# EasyEDA Pro project ProDoc_FDSKey_PCB.epro

# Board PCB1_6
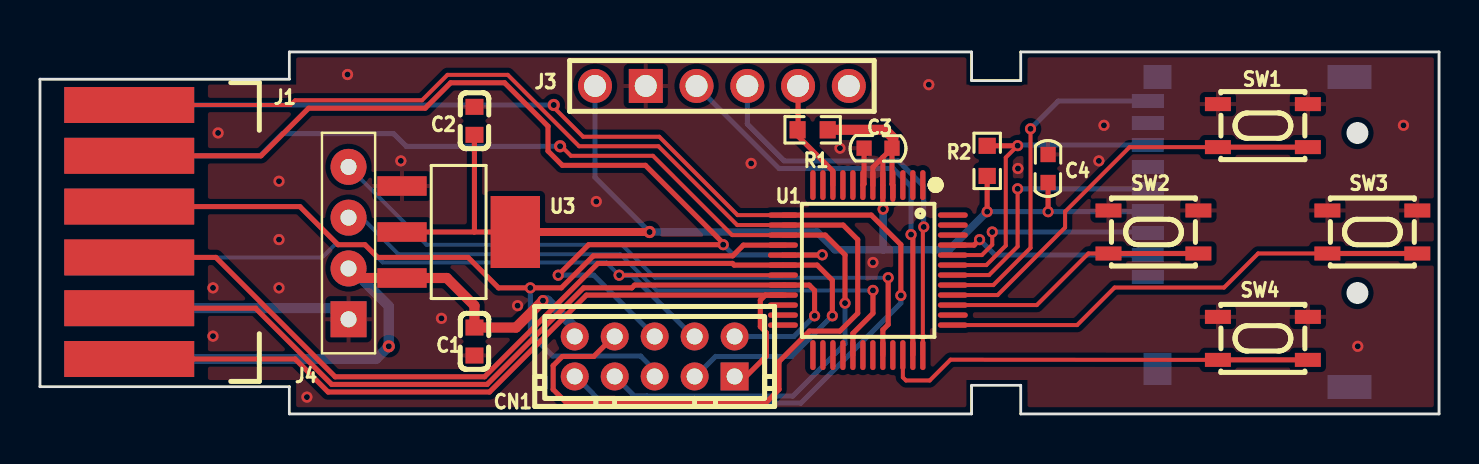
[diagram p0: board, top side]
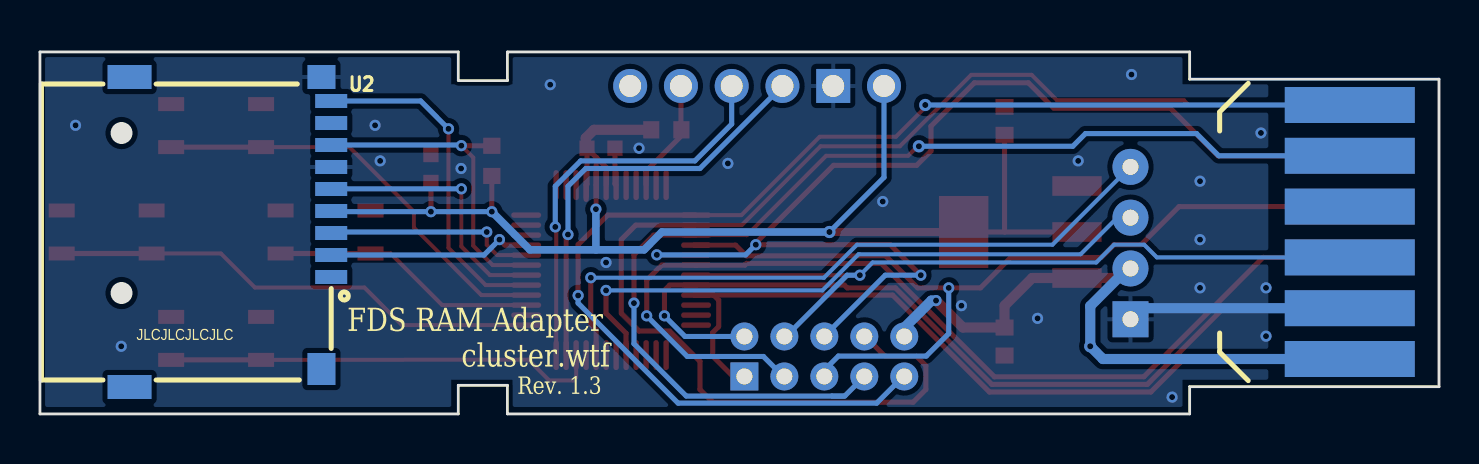
[diagram p1: board, bottom side, seen from below]

Outline 70 x 18.1 mm; copper layers: Top Layer, Bottom Layer. Coordinates in mm from the lower left corner of the outline.
Outline path: 0,16.74 12.48,16.74 12.48,18.1 46.61,18.1 46.61,16.67 49.07,16.67 49.07,18.1 70,18.1 70,0 49.07,0 49.07,1.43 46.61,1.43 46.61,0 12.48,0 12.48,1.36 0,1.36 0,16.74
Stack: Top Layer 0.035mm / Dielectric1 1.51mm FR4 er 4.5 / Bottom Layer 0.035mm

## Design rules (mm)
template: JLCPCB Capability(Two Layers Board)
spacing copperThickness1oz (default): track to track 0.102, other pairs 0.152 to 0.3
spacing copperThickness2oz: track to track 0.203, other pairs 0.152 to 0.3
track width copperThickness1oz (default): min 0.127, default 0.254, max 2.54
track width copperThickness2oz: min 0.203, default 0.254, max 2.54
differential pair differentialPair (default): width min 0.127, default 0.254, max 2.54; gap min 0.152, default 0.152
via viaSize (default): diameter min 0.5, default 0.61, max 10; hole min 0.3, default 0.305, max 6.3

## Placement (name value [footprint] x y rotation side)
C1  4.7uF  [C0603#2]  21.74 3.62 270 top
C2  4.7uF  [C0603#2]  21.74 14.65 270 top
C3  100nF  [C0603]  41.93 13.29 0 top
C4  100nF  [C0603]  50.44 12.27 270 top
CN1  A2004-2X05A  [CONN-TH_10P-P2.00_A2004WV-2X05P]  30.75 2.87 0 top
J1  -  [FDS_RAM_ADAPTOR]  0.66 17.03 270 top
J3  SWD  [hdr-1x6t/2.54/15x2]  34.12 16.4 0 top
J4  -  [OLED_0.91]  13.99 2.49 0 top
R1  1.5kΩ  [R0603]  38.66 14.21 180 top
R2  1.5kΩ  [R0603]  47.39 12.65 270 top
SW1  3*4*2.5mm 贴片4脚  [SW-SMD_4P-L4.2-W3.3-P2.15-LS5.1]  61.19 14.41 180 top
SW2  3*4*2.5mm 贴片4脚  [SW-SMD_4P-L4.2-W3.3-P2.15-LS5.1]  55.71 9.1 180 top
SW3  3*4*2.5mm 贴片4脚  [SW-SMD_4P-L4.2-W3.3-P2.15-LS5.1]  66.66 9.1 180 top
SW4  3*4*2.5mm 贴片4脚  [SW-SMD_4P-L4.2-W3.3-P2.15-LS5.1]  61.19 3.78 180 top
U1  STM32G0B0CET6  [LQFP-48_L7.0-W7.0-P0.50-LS9.0-BL]  41.42 7.19 180 top
U2  A102-206017-001  [SIM-SMD_A102-206017-001]  60.47 9.1 270 bottom
U3  -  [SOT-223-4_L6.5-W3.5-P2.30-LS7.0-BR]  20.95 9.1 180 top

## Footprints (pads in the part's own frame, mm; a bottom-side part is the same pattern mirrored in y, then rotated)
C0603
  rect 0.762x0.762 smd: 1(-0.699,0) 2(0.699,0)
C0603#2
  rect 0.8x0.9 smd: 1(-0.7,0) 2(0.7,0)
CONN-TH_10P-P2.00_A2004WV-2X05P
  rect 1.4x1.4 hole 0.8: 1(4,-1)
  round 1.4 hole 0.8: 2(4,1) 3(2,-1) 4(2,1) 5(0,-1) 6(0,1) 7(-2,-1) 8(-2,1) 9(-4,-1) 10(-4,1)
FDS_RAM_ADAPTOR
  rect 1.8x6.5 smd: 1(14.288,3.81) 3(11.747,3.81) 5(9.207,3.81) 7(6.668,3.81) 9(4.128,3.81) 11(1.587,3.81)
  rect 1.8x6.5 smd far side: 2(14.288,3.81) 4(11.747,3.81) 6(9.207,3.81) 8(6.668,3.81) 10(4.128,3.81) 12(1.587,3.81)
hdr-1x6t/2.54/15x2
  round 1.7 hole 1.1: 1(-6.35,0) 3(-1.27,0) 4(1.27,0) 5(3.81,0) 6(6.35,0)
  rect 1.7x1.7 hole 1.1: 2(-3.81,0)
LQFP-48_L7.0-W7.0-P0.50-LS9.0-BL
  oval 0.27x1.5 smd: 1(-2.75,-4.25) 2(-2.25,-4.25) 3(-1.75,-4.25) 4(-1.25,-4.25) 5(-0.75,-4.25) 6(-0.25,-4.25) 7(0.25,-4.25) 8(0.75,-4.25) 9(1.25,-4.25) 10(1.75,-4.25) 11(2.25,-4.25) 12(2.75,-4.25) 25(2.75,4.25) 26(2.25,4.25) 27(1.75,4.25) 28(1.25,4.25) 29(0.75,4.25) 30(0.25,4.25) 31(-0.25,4.25) 32(-0.75,4.25) 33(-1.25,4.25) 34(-1.75,4.25) 35(-2.25,4.25) 36(-2.75,4.25)
  oval 1.5x0.27 smd: 13(4.25,-2.75) 14(4.25,-2.25) 15(4.25,-1.75) 16(4.25,-1.25) 17(4.25,-0.75) 18(4.25,-0.25) 19(4.25,0.25) 20(4.25,0.75) 21(4.25,1.25) 22(4.25,1.75) 23(4.25,2.25) 24(4.25,2.75) 37(-4.25,2.75) 38(-4.25,2.25) 39(-4.25,1.75) 40(-4.25,1.25) 41(-4.25,0.75) 42(-4.25,0.25) 43(-4.25,-0.25) 44(-4.25,-0.75) 45(-4.25,-1.25) 46(-4.25,-1.75) 47(-4.25,-2.25) 48(-4.25,-2.75)
OLED_0.91
  rect 1.8x1.8 hole 0.8: 1(1.447,2.241)
  round 1.8 hole 0.8: 2(1.447,4.781) 3(1.447,7.321) 4(1.447,9.861)
R0603
  rect 0.806x0.864 smd: 1(-0.753,0) 2(0.753,0)
SIM-SMD_A102-206017-001
  rect 0.7x1.6 smd: 1(2.25,5.045) 2(1.15,5.045) 3(0.05,5.045) 4(-1.05,5.045) 5(-2.15,5.045) 6(-3.25,5.045) 7(-4.35,5.045) 8(-5.45,5.045) SD(-6.55,5.045)
  rect 1.6x1.4 smd: 11(6.85,4.555)
  rect 1.2x2.2 smd: 12(-7.75,-5.045) 13(7.75,-5.045)
  rect 1.2x1.4 smd: G(-7.75,4.555)
SOT-223-4_L6.5-W3.5-P2.30-LS7.0-BR
  rect 2.47x0.98 smd: 1(2.835,-2.3) 2(2.835,0) 3(2.835,2.3)
  rect 2.47x3.6 smd: 4(-2.835,0)
SW-SMD_4P-L4.2-W3.3-P2.15-LS5.1
  rect 1.3x0.7 smd: 1(-2.25,1.075) 2(2.25,1.075) 3(-2.25,-1.075) 4(2.25,-1.075)

## Nets
3.3V: C2.2 C3.2 C4.2 J3.1 R1.1 R2.2 U1.4 U1.5 U1.6 U2.4 U3.2 U3.4
+5V: C1.1 CN1.10 J1.2 J4.2 U3.3
GND: C1.2 C2.1 C3.1 C4.1 J1.4 J3.2 J4.1 SW1.3 SW1.4 SW2.3 SW2.4 SW3.3 SW3.4 SW4.3 SW4.4 U1.7 U2.6 U2.G U3.1
BUTTON_1: SW1.1 SW1.2 U1.40
BUTTON_2: SW2.1 SW2.2 U1.39
BUTTON_3: SW3.1 SW3.2 U1.37
BUTTON_4: SW4.1 SW4.2 U1.34
I2C_SCL: J4.3 U1.29
I2C_SDA: J4.4 U1.32
MEDIA_SET: CN1.7 J1.10 U1.15
MOTOR_ON: CN1.4 J1.6 U1.19
NRST: J3.5 R1.2 U1.10
READ_DATA: CN1.6 J1.9 U1.17
READY: CN1.8 J1.11 U1.14
SCAN_MEDIA: CN1.2 J1.3 U1.20
SD_CLK: U1.42 U2.5
SD_CS: U1.45 U2.2
SD_DTCT: U1.41 U2.SD
SD_MISO: R2.1 U1.43 U2.7
SD_MOSI: U1.44 U2.3
STOP_MOTOR: CN1.9 J1.12 U1.13
SWCLK: J3.4 U1.36
SWDIO: J3.3 U1.35
WRITABLE_MEDIA: CN1.5 J1.7 U1.16
WRITE: CN1.1 J1.1 U1.21
WRITE_DATA: CN1.3 J1.5 U1.18

Pads without a net: J1 8; J3 6; U1 1 2 3 8 9 11 12 22 23 24 25 26 27 28 30 31 33 38 46 47 48; U2 1 8 11 12 13

## Via types
v1: diameter 0.559, hole 0.3, Top Layer to Bottom Layer, 41 vias
v2: diameter 0.559, hole 0.305, Top Layer to Bottom Layer, 2 vias
v3: diameter 0.61, hole 0.305, Top Layer to Bottom Layer, 4 vias

## Routing (per net, layer and track width the routed paths; a pad name or vN(x,y) marks a point on that pad's centre or on a via; arc(x,y) is an arc through that point)
3.3V: length 68.2
  Top Layer w0.254: 42.67,10.73 U1.4 42.63,11.48 C3.2 42.17,12.83 ; 42.17,12.83 U1.5 42.17,10.23 v1(42.18,10.24) ; 42.17,12.83 41.67,12.33 U1.6 ; 21.73,9.1 U3.2 ; 21.73,9.1 21.74,9.11 C2.2 ; 21.73,9.1 U3.4 ; v1(50.44,10.11) C4.2 ; v1(47.39,10.11) R2.2
  Top Layer w0.4: U3.4 30.24,9.1
  Top Layer w0.508: C3.2 42.69,13.35 42.69,13.79 42.28,14.21 R1.1
  Bottom Layer w0.254: U2.4 55.39,10.11 v1(50.44,10.11) v1(47.39,10.11) ; J3.1 27.77,11.83 v3(30.5,9.1)
  Bottom Layer w0.381: 42.18,8.21 39.77,8.21 38.88,9.1 v3(30.5,9.1) ; 42.18,8.21 v1(42.18,10.24) ; 42.18,8.21 45.49,8.21 v1(47.39,10.11)
+5V: length 33.3
  Top Layer w0.508: v1(25.17,5.67) 23.82,4.32 C1.1 21.74,5.41 20.35,6.8 U3.3 15.92,6.8 15.49,7.23
  Bottom Layer w0.508: v1(25.17,5.67) 25.4,5.67 26.75,4.31 CN1.10 ; 3.78,2.75 16.82,2.75 v3(17.45,3.38) 17.45,5.39 15.61,7.23 15.49,7.23
GND: length 13.8
  Top Layer w0.254: C3.1 41.23,11.5 U1.7
  Bottom Layer w0.508: 3.78,5.29 14.89,5.29 15.49,4.69
  vias: v1(8.66,6.3) v1(8.66,3.89) v1(8.91,14.05) v1(11.96,11.64) v1(11.96,8.71) v1(11.96,6.3) v1(13.36,0.84) v1(15.39,16.97) v1(18.05,12.65) v1(20.09,4.78) v1(23.9,5.41) v1(27.83,10.62) v1(35.58,12.52) v1(40.03,13.29) v1(41.68,7.57) v1(44.47,16.46) v1(48.93,12.27) v1(52.98,12.65) v1(53.23,14.43) v1(65.93,3.38) v1(68.22,14.43)
BUTTON_1: length 21.6
  Top Layer w0.2: 59.22,13.34 54.52,13.34 51.29,10.11 51.29,9.32 47.91,5.94 U1.40
  Top Layer w0.254: SW1.1 58.94,13.34
BUTTON_2: length 13.6
  Top Layer w0.2: 53.74,8.02 52.45,8.02 49.87,5.44 U1.39
  Top Layer w0.254: 57.96,8.02 53.46,8.02
BUTTON_3: length 25
  Top Layer w0.2: 64.69,8.02 60.95,8.02 59.24,6.32 53.77,6.32 51.89,4.44 U1.37
  Top Layer w0.254: 64.41,8.02 68.91,8.02
BUTTON_4: length 22.2
  Top Layer w0.2: 59.22,2.7 45.56,2.71 44.52,1.67 43.33,1.67 43.17,1.83 U1.34
  Top Layer w0.254: SW4.1 58.94,2.7
I2C_SCL: length 31.3
  Top Layer w0.254: U1.29 40.67,4.03 41.68,5.03 v1(41.68,6.17)
  Bottom Layer w0.2: 15.49,9.77 16.14,9.77 17.93,7.98 29.04,7.98 30.85,6.17 v1(41.68,6.17)
I2C_SDA: length 33.2
  Top Layer w0.254: U1.32 42.17,4.2 42.44,4.47 v1(42.44,6.81)
  Bottom Layer w0.2: 15.49,12.31 19.34,8.46 29.12,8.46 30.77,6.81 v1(42.44,6.81)
MEDIA_SET: length 57.8
  Top Layer w0.2: 25.9,13.38 26.09,13.38 26.56,12.91 30.67,12.91 34.63,8.94 U1.15
  Top Layer w0.254: U1.15 39.29,8.94 40.28,7.95 v1(40.28,5.54)
  Bottom Layer w0.254: v3(26.02,13.38) 18.32,13.38 17.69,14.02 12.13,14.02 11.02,12.91 3.78,12.91 ; 29.2,1.75 29.2,1.51 ; CN1.7 29.73,0.89 30.38,0.89 ; 30.38,0.89 37.67,0.89 40.28,3.51 v1(40.28,5.54) ; 30.38,0.89 29.81,0.89
MOTOR_ON: length 39.4
  Top Layer w0.2: U1.19 37.17,6.94 v1(28.98,6.94)
  Bottom Layer w0.2: v1(28.98,6.94) 28.34,7.57 17.15,7.57 16.26,8.46 14.75,8.46 14.12,7.83 3.78,7.83
  Bottom Layer w0.254: 32.8,3.75 29.61,6.94 v1(28.98,6.94)
NRST: length 5.7
  Top Layer w0.254: J3.5 37.93,14.23 R1.2 37.91,13.91 39.67,12.14 U1.10
READ_DATA: length 58.3
  Top Layer w0.254: 3.78,12.91 11.06,12.91 13.44,15.29 19.28,15.29 20.55,16.56 23.24,16.56 25.42,14.38 25.42,13.14 26.13,12.43 30.29,12.43 34.18,8.54 v2(34.18,8.46) 27.45,8.46 v1(25.93,6.94) ; U1.17 39.12,7.94 v2(39.14,7.95)
  Bottom Layer w0.254: v2(34.18,8.46) 34.69,7.95 v2(39.14,7.95) ; v1(25.93,6.94) 27.71,6.94 30.9,3.75
READY: length 67.8
  Top Layer w0.2: 37.29,9.44 34.89,9.44 30.94,13.38 26.98,13.38 23.4,16.95 20.39,16.95 19.12,15.68 12.77,15.68 12.53,15.45 3.78,15.45
  Top Layer w0.254: U1.14 40.19,9.44 40.91,8.71 40.91,5.03 40.03,4.14 38.5,4.14 36.98,2.62 36.98,1.22 36.34,0.59 26.31,0.59 25.67,1.22 25.67,2.41 26.13,2.87 27.71,2.87 28.58,3.75
SCAN_MEDIA: length 44.5
  Top Layer w0.254: 37.29,6.44 29.75,6.44 29.61,6.3 27.2,6.3 22.37,1.48 14.59,1.48 10.78,5.29 3.78,5.29 ; U1.20 38.49,6.44 38.76,6.17 v1(38.76,4.9)
  Bottom Layer w0.254: CN1.2 37.72,3.87 v1(38.76,4.9)
SD_CLK: length 13.2
  Top Layer w0.2: v1(48.92,11.25) 48.92,8.37 47.48,6.94 U1.42
  Bottom Layer w0.254: U2.5 55.42,11.25 v1(48.92,11.25)
SD_CS: length 10.2
  Top Layer w0.254: v1(47.01,8.71) 46.74,8.44 U1.45
  Bottom Layer w0.254: v1(47.01,8.71) 47.78,7.95 U2.2
SD_DTCT: length 17.1
  Top Layer w0.2: U1.41 47.7,6.44 49.56,8.3 v1(49.56,14.26)
  Bottom Layer w0.254: U2.SD 50.95,15.65 v1(49.56,14.26)
SD_MISO: length 16.3
  Top Layer w0.2: U1.43 47.35,7.44 48.32,8.41 48.32,12.82 48.91,13.41
  Top Layer w0.254: R2.1 48.91,13.41 v1(48.92,13.41)
  Bottom Layer w0.254: U2.7 48.95,13.45 v1(48.92,13.41)
SD_MOSI: length 10.6
  Top Layer w0.2: v1(47.65,9.1) 47.65,8.46 47.13,7.94 U1.44
  Bottom Layer w0.254: v1(47.65,9.1) 55.38,9.1 U2.3
STOP_MOTOR: length 64.2
  Top Layer w0.2: U1.13 34.9,9.94 30.98,13.86 27.17,13.86 25.59,15.45
  Top Layer w0.254: v1(43.07,5.92) 43.07,8.46 41.59,9.94 U1.13
  Bottom Layer w0.254: 26.94,1.98 26.94,1.73 28.14,0.54 38.07,0.54 43.07,5.54 v1(43.07,5.92) ; 3.78,15.45 v3(25.71,15.45)
SWCLK: length 20.6
  Top Layer w0.2: U1.36 44.17,9.48
  Bottom Layer w0.254: J3.4 35.39,14.49 37.23,12.65 42.95,12.65 44.22,11.38 v1(44.22,9.35)
SWDIO: length 21.3
  Top Layer w0.254: v1(43.58,8.97) 43.67,8.88 U1.35
  Bottom Layer w0.254: J3.3 36.98,12.27 42.69,12.27 43.58,11.38 v1(43.58,8.97)
WRITABLE_MEDIA: length 45.7
  Top Layer w0.254: 3.78,10.37 13.01,10.37 14.91,8.46 16.26,8.46 16.89,7.83 21.42,7.83 22.94,6.3 v1(24.53,6.3) 26.08,6.3 27.68,7.9 34.66,7.9 35.19,8.44 37.29,8.44
  Bottom Layer w0.254: CN1.5 30.75,2.19 30.05,2.89 25.65,2.89 24.53,4.02 v1(24.53,6.3)
WRITE: length 42.4
  Top Layer w0.254: 36.3,5.94 36.04,5.69 36.04,4.36 36.34,4.06 36.34,2.89 35.33,1.87 CN1.1 ; 36.3,5.94 37.29,5.94 ; 36.3,5.94 27.34,5.94 22.49,1.09 14.42,1.09 12.77,2.75 3.78,2.75 ; U1.21 36.3,5.94
WRITE_DATA: length 51
  Top Layer w0.254: v1(39.64,4.9) 39.64,6.68 38.89,7.44 U1.18 34.73,7.44 34.65,7.53 27.92,7.53 22.25,1.86 14.77,1.86 8.8,7.83 3.78,7.83
  Bottom Layer w0.254: CN1.3 32.8,1.87 33.8,2.87 37.61,2.87 v1(39.64,4.9)

## Copper pours and planes (outline as drawn; the poured copper is in the pictures)
GND on Top Layer: 8.4,1.69 8.4,16.47 12.82,16.47 12.82,17.83 46.35,17.83 46.35,16.47 49.41,16.47 49.41,17.83 69.74,17.83 69.74,0.33 49.41,0.33 49.41,1.69 46.35,1.69 46.35,0.33 12.82,0.33 12.82,1.69
GND on Bottom Layer: 8.54,1.71 8.54,16.48 12.83,16.48 12.83,17.84 46.36,17.84 46.36,16.48 49.42,16.48 49.42,17.84 69.75,17.84 69.75,0.35 49.42,0.35 49.42,1.71 46.36,1.71 46.36,0.35 12.83,0.35 12.83,1.71

## Text on the board
Bottom Silkscreen Layer: JLCJLCJLCJLC | Rev. 1.3 | cluster.wtf | FDS RAM Adapter
